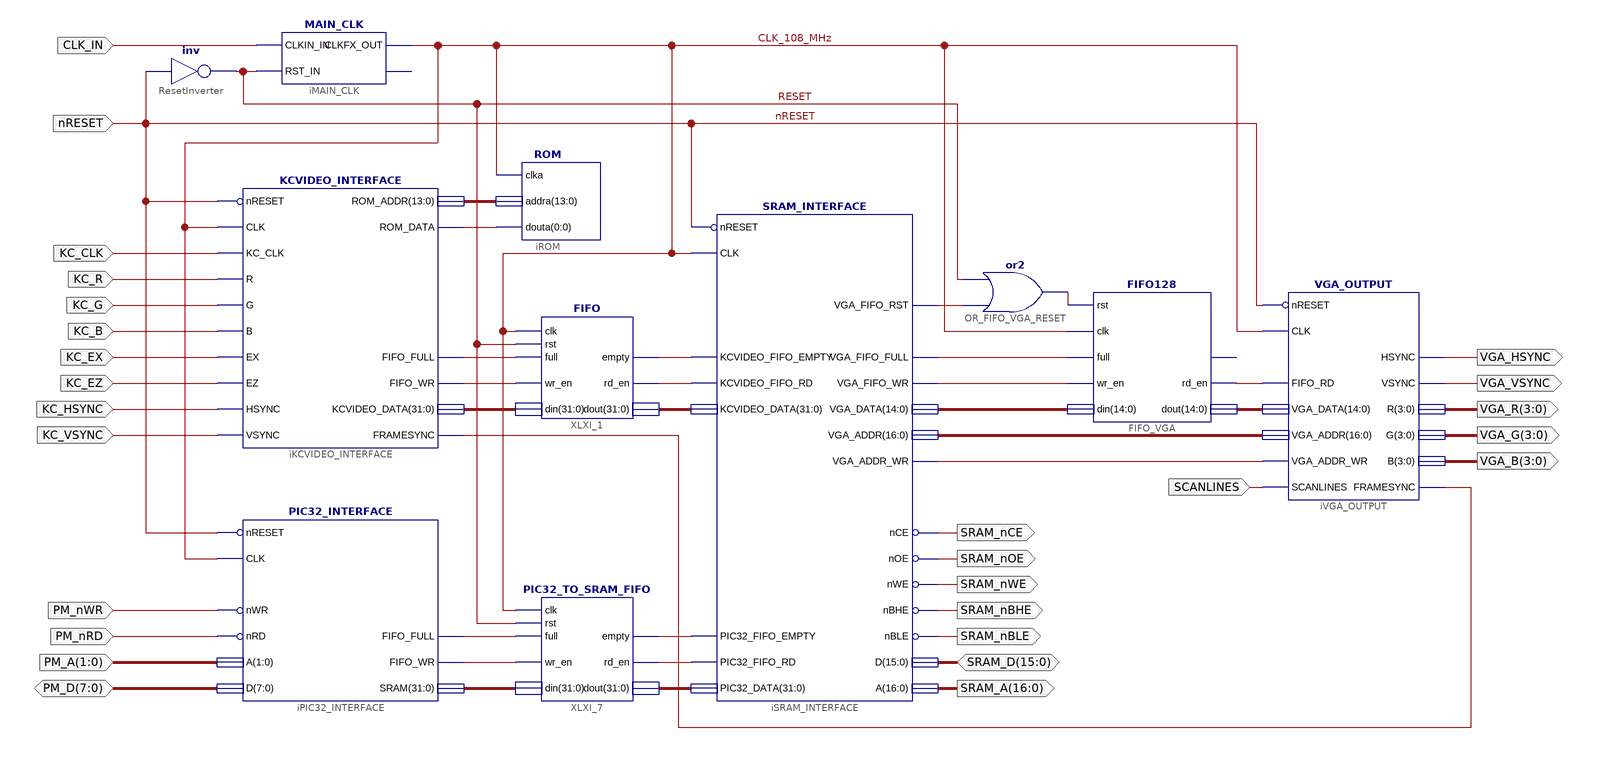
[diagram p0: schematic sheet 1]
// Xilinx ISE schematic TOP_LEVEL.sch (spartan3a) as structural Verilog: 11 symbols, 27 ports
module TOP_LEVEL (
  input  CLK_IN,
  input  nRESET,
  input  PM_nWR,
  input  PM_nRD,
  input  [1:0] PM_A,
  input  KC_CLK,
  input  KC_EX,
  input  KC_B,
  input  KC_G,
  input  KC_R,
  input  KC_VSYNC,
  input  KC_HSYNC,
  input  KC_EZ,
  input  SCANLINES,
  inout  [7:0] PM_D,
  inout  [15:0] SRAM_D,
  output [3:0] VGA_B,
  output [3:0] VGA_G,
  output VGA_VSYNC,
  output VGA_HSYNC,
  output [3:0] VGA_R,
  output SRAM_nCE,
  output SRAM_nOE,
  output SRAM_nWE,
  output SRAM_nBHE,
  output SRAM_nBLE,
  output [16:0] SRAM_A
);

  wire CLK_108_MHz, FIFO_VGA_FULL, FIFO_VGA_RD, FIFO_VGA_RST, FIFO_VGA_WR, KCVIDEO_FIFO_WR, RESET,
       VGA_ADDR_WR, XLXN_348, XLXN_349, XLXN_1141, XLXN_1161, XLXN_1167, XLXN_1168, XLXN_1171, XLXN_1172,
       XLXN_1174;
  wire [0:0] LOGO_D;
  wire [13:0] LOGO_A;
  wire [14:0] FIFO_VGA_DATA, VGA_DATA;
  wire [16:0] VGA_ADDR;
  wire [31:0] KCVIDEO_DATA, KCVIDEO_FIFO_DATA, XLXN_1166, XLXN_1173;

  not ResetInverter (RESET, nRESET);
  MAIN_CLK iMAIN_CLK (.CLKIN_IN(CLK_IN), .RST_IN(RESET), .CLKFX_OUT(CLK_108_MHz));  // open: CLK0_OUT
  VGA_OUTPUT iVGA_OUTPUT (
    .VGA_DATA(VGA_DATA), .VGA_ADDR(VGA_ADDR), .VGA_ADDR_WR(VGA_ADDR_WR), .FIFO_RD(FIFO_VGA_RD),
    .CLK(CLK_108_MHz), .nRESET(nRESET), .HSYNC(VGA_HSYNC), .VSYNC(VGA_VSYNC), .R(VGA_R), .G(VGA_G),
    .B(VGA_B), .SCANLINES(SCANLINES), .FRAMESYNC(XLXN_1174));
  FIFO128 FIFO_VGA (
    .rst(FIFO_VGA_RST), .clk(CLK_108_MHz), .full(FIFO_VGA_FULL), .wr_en(FIFO_VGA_WR), .din(FIFO_VGA_DATA),
    .dout(VGA_DATA), .rd_en(FIFO_VGA_RD));  // open: empty
  or OR_FIFO_VGA_RESET (FIFO_VGA_RST, XLXN_1141, RESET);
  SRAM_INTERFACE iSRAM_INTERFACE (
    .nRESET(nRESET), .KCVIDEO_DATA(KCVIDEO_FIFO_DATA), .CLK(CLK_108_MHz), .KCVIDEO_FIFO_RD(XLXN_348),
    .VGA_ADDR(VGA_ADDR), .VGA_DATA(FIFO_VGA_DATA), .VGA_ADDR_WR(VGA_ADDR_WR), .VGA_FIFO_FULL(FIFO_VGA_FULL),
    .VGA_FIFO_RST(XLXN_1141), .VGA_FIFO_WR(FIFO_VGA_WR), .KCVIDEO_FIFO_EMPTY(XLXN_349), .nWE(SRAM_nWE),
    .nOE(SRAM_nOE), .nCE(SRAM_nCE), .A(SRAM_A), .D(SRAM_D), .nBLE(SRAM_nBLE), .nBHE(SRAM_nBHE),
    .PIC32_DATA(XLXN_1173), .PIC32_FIFO_RD(XLXN_1172), .PIC32_FIFO_EMPTY(XLXN_1171));
  KCVIDEO_INTERFACE iKCVIDEO_INTERFACE (
    .KCVIDEO_DATA(KCVIDEO_DATA), .FIFO_WR(KCVIDEO_FIFO_WR), .EX(KC_EX), .B(KC_B), .G(KC_G), .R(KC_R),
    .CLK(CLK_108_MHz), .nRESET(nRESET), .KC_CLK(KC_CLK), .ROM_ADDR(LOGO_A), .ROM_DATA(LOGO_D[0]),
    .VSYNC(KC_VSYNC), .HSYNC(KC_HSYNC), .EZ(KC_EZ), .FIFO_FULL(XLXN_1161), .FRAMESYNC(XLXN_1174));
  ROM iROM (.clka(CLK_108_MHz), .addra(LOGO_A), .douta(LOGO_D[0]));
  FIFO XLXI_1 (
    .dout(KCVIDEO_FIFO_DATA), .din(KCVIDEO_DATA), .rd_en(XLXN_348), .empty(XLXN_349), .clk(CLK_108_MHz),
    .rst(RESET), .full(XLXN_1161), .wr_en(KCVIDEO_FIFO_WR));
  PIC32_INTERFACE iPIC32_INTERFACE (
    .nWR(PM_nWR), .nRD(PM_nRD), .CLK(CLK_108_MHz), .nRESET(nRESET), .FIFO_WR(XLXN_1167), .SRAM(XLXN_1166),
    .A(PM_A), .D(PM_D), .FIFO_FULL(XLXN_1168));
  PIC32_TO_SRAM_FIFO XLXI_7 (
    .clk(CLK_108_MHz), .rst(RESET), .full(XLXN_1168), .din(XLXN_1166), .wr_en(XLXN_1167), .empty(XLXN_1171),
    .dout(XLXN_1173), .rd_en(XLXN_1172));
endmodule
